# EAGLE schematic KastlController (EAGLE 7.4.0)
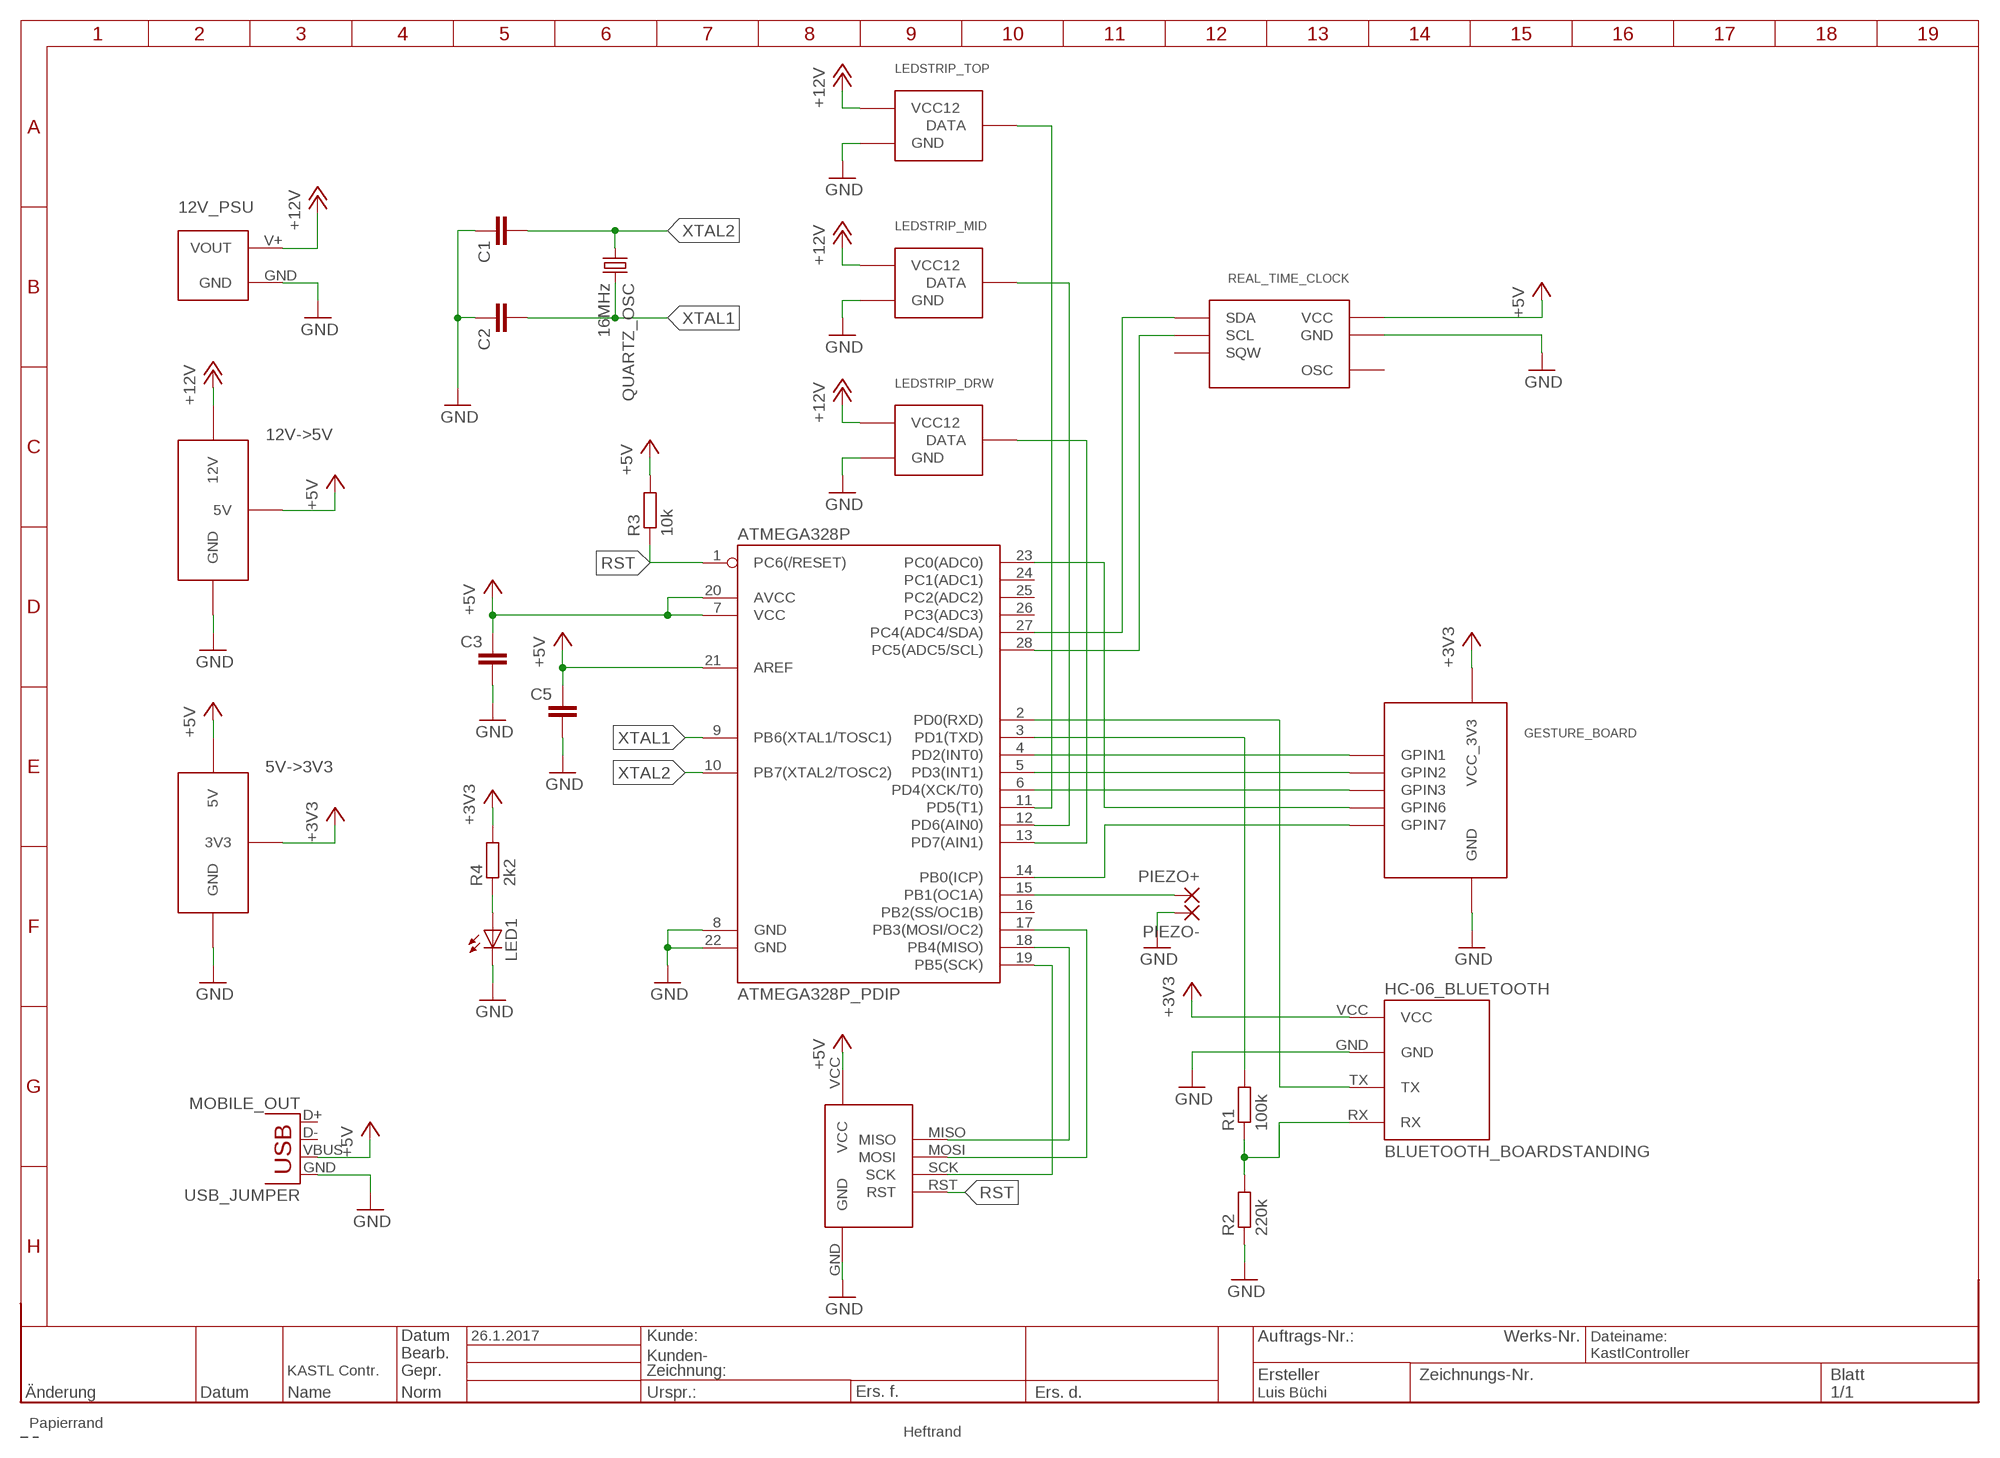
[diagram p0: schematic, sheet 1]
RAHMEN1 (RAHMEN_A4): DATUM: 26.1.2017; ERSTELLER: Luis Büchi; NAME1: KASTL Contr.

## Parts
5V->3V3  VOLTAGE_REG_5V_3V3  [3_PIN_HEADER]
12V->5V  VOLTAGE_REG_12V_5V  [3_PIN_HEADER_BIG]
12V_PSU  PWR_CONNECTOR  [2PIN_CONN]
ATMEGA328P  ATMEGA328P_PDIP  [DIL28-3]
C1  C-EU_025-024X044  [C2.5-2]
C2  C-EU_025-024X044  [C2.5-2]
C3  C-EU_025-024X044  [C2.5-2]
C5  C-EU_025-024X044  [C2.5-2]
GESTURE_BOARD  GESTUREBOARD  [INTERFACE_AND_POWER_CONN]
HC-06_BLUETOOTH  BLUETOOTH_BOARDSTANDING  [BT_BOARD_FOOTPRINT_STANDING]
LED1  LEDS_5MM  [LED5MM]
LEDSTRIP_DRW  WS2812_JMP  [WS2812_JUMPER]
LEDSTRIP_MID  WS2812_JMP  [WS2812_JUMPER]
LEDSTRIP_TOP  WS2812_JMP  [WS2812_JUMPER]
MOBILE_OUT  USB_JUMPER  [USB_JUMPER]
PIEZO+  1,6/0,9  [1,6/0,9]
PIEZO-  1,6/0,9  [1,6/0,9]
QUARTZ_OSC  16MHz  CRYSTALHC33U-V  [HC33U-V]
R1  100k  R-EU_0204/2V  [R-2,5]
R2  220k  R-EU_0204/2V  [R-2,5]
R3  10k  R-EU_0204/2V  [R-2,5]
R4  2k2  R-EU_0204/2V  [R-2,5]
REAL_TIME_CLOCK  DS3231_RTC_MODULE  [6P_HEADER]
U$1  INTEGRATED_PROGRAMMING_INTERFACE  [6PIN_HEADER]

## Nets
+3V3: 5V->3V3.PIN2(3V3) GESTURE_BOARD.VCC_3V3 HC-06_BLUETOOTH.VCC R4.2
+5V: 5V->3V3.PIN1(5V) 12V->5V.PIN1(5V) ATMEGA328P.7(VCC) ATMEGA328P.20(AVCC) ATMEGA328P.21(AREF) C3.1 C5.1 MOBILE_OUT.VBUS R3.2 REAL_TIME_CLOCK.VCC U$1.VCC
+12V: 12V->5V.PIN3(12V) 12V_PSU.V+(VOUT) LEDSTRIP_DRW.VCC12 LEDSTRIP_MID.VCC12 LEDSTRIP_TOP.VCC12
GND: 5V->3V3.PIN3(GND) 12V->5V.PIN2(GND) 12V_PSU.GND ATMEGA328P.8(GND) ATMEGA328P.22(GND) C1.1 C2.1 C3.2 C5.2 GESTURE_BOARD.GND HC-06_BLUETOOTH.GND LED1.K(C) LEDSTRIP_DRW.GND1(GND) LEDSTRIP_DRW.GND2(GND) LEDSTRIP_MID.GND1(GND) LEDSTRIP_MID.GND2(GND) LEDSTRIP_TOP.GND1(GND) LEDSTRIP_TOP.GND2(GND) MOBILE_OUT.GND PIEZO-.1(P) R2.1 REAL_TIME_CLOCK.GND U$1.GND
N$1: ATMEGA328P.11(PD5(T1)) LEDSTRIP_TOP.DATA
N$2: ATMEGA328P.12(PD6(AIN0)) LEDSTRIP_MID.DATA
N$3: ATMEGA328P.4(PD2(INT0)) GESTURE_BOARD.GPIN1
N$4: ATMEGA328P.5(PD3(INT1)) GESTURE_BOARD.GPIN2
N$5: ATMEGA328P.6(PD4(XCK/T0)) GESTURE_BOARD.GPIN3
N$6: ATMEGA328P.23(PC0(ADC0)) GESTURE_BOARD.GPIN6
N$7: ATMEGA328P.14(PB0(ICP)) GESTURE_BOARD.GPIN7
N$8: ATMEGA328P.13(PD7(AIN1)) LEDSTRIP_DRW.DATA
N$9: ATMEGA328P.3(PD1(TXD)) R1.2
N$10: LED1.A R4.1
N$11: ATMEGA328P.18(PB4(MISO)) U$1.MISO
N$12: ATMEGA328P.15(PB1(OC1A)) PIEZO+.1(P)
N$13: ATMEGA328P.27(PC4(ADC4/SDA)) REAL_TIME_CLOCK.SDA
N$14: ATMEGA328P.2(PD0(RXD)) HC-06_BLUETOOTH.TX
N$15: ATMEGA328P.28(PC5(ADC5/SCL)) REAL_TIME_CLOCK.SCL
N$16: HC-06_BLUETOOTH.RX R1.1 R2.2
N$17: ATMEGA328P.17(PB3(MOSI/OC2)) U$1.MOSI
N$18: ATMEGA328P.19(PB5(SCK)) U$1.SCK
RST: ATMEGA328P.1(PC6(/RESET)) R3.1 U$1.RST
XTAL1: ATMEGA328P.9(PB6(XTAL1/TOSC1)) C2.2 QUARTZ_OSC.2
XTAL2: ATMEGA328P.10(PB7(XTAL2/TOSC2)) C1.2 QUARTZ_OSC.1
Unconnected: ATMEGA328P.16(PB2(SS/OC1B)) ATMEGA328P.24(PC1(ADC1)) ATMEGA328P.25(PC2(ADC2)) ATMEGA328P.26(PC3(ADC3)) MOBILE_OUT.D+ MOBILE_OUT.D- REAL_TIME_CLOCK.OSC REAL_TIME_CLOCK.SQW

## Library data of the parts
5V->3V3 = Voltage_Regulators:VOLTAGE_REG_5V_3V3
12V->5V = Voltage_Regulators:VOLTAGE_REG_12V_5V
12V_PSU = PowerConnector:PWR_CONNECTOR
ATMEGA328P = SparkFun-DigitalIC:ATMEGA328P_PDIP: uC used in the Arduino 32kb flash, 1k EEPROM, 2k SRAM This is the through-hole version of this chip.
C1-C3 C5 = htl3r-discrete:C-EU_: CAPACITOR, European symbol
GESTURE_BOARD = gestureBoardInterface_Kastl:GESTUREBOARD
HC-06_BLUETOOTH = Bluetooth_HC-06:BLUETOOTH_BOARD: Bluetooth Board V1.05
LED1 = htl3r-discrete:LEDS_: LED diverse leds
LEDSTRIP_DRW LEDSTRIP_MID LEDSTRIP_TOP = WS2812_Kastl:WS2812_JMP
MOBILE_OUT = SparkFun-Connectors:USB_JUMPER
PIEZO+ PIEZO- = wirepad:1,6/0,9: THROUGH-HOLE PAD
QUARTZ_OSC = crystal:CRYSTAL: CRYSTAL; OC_FARNELL: unknown; OC_NEWARK: unknown
R1-R4 = htl3r-discrete:R-EU_: RESISTOR, European symbol
REAL_TIME_CLOCK = DS3231_RTC:DS3231_RTC_MODULE
U$1 = IPI:INTEGRATED_PROGRAMMING_INTERFACE